# Altium schematic sheet Inertial_systems.SchDoc
size A4; SheetNumber: 9; SheetTotal: 11
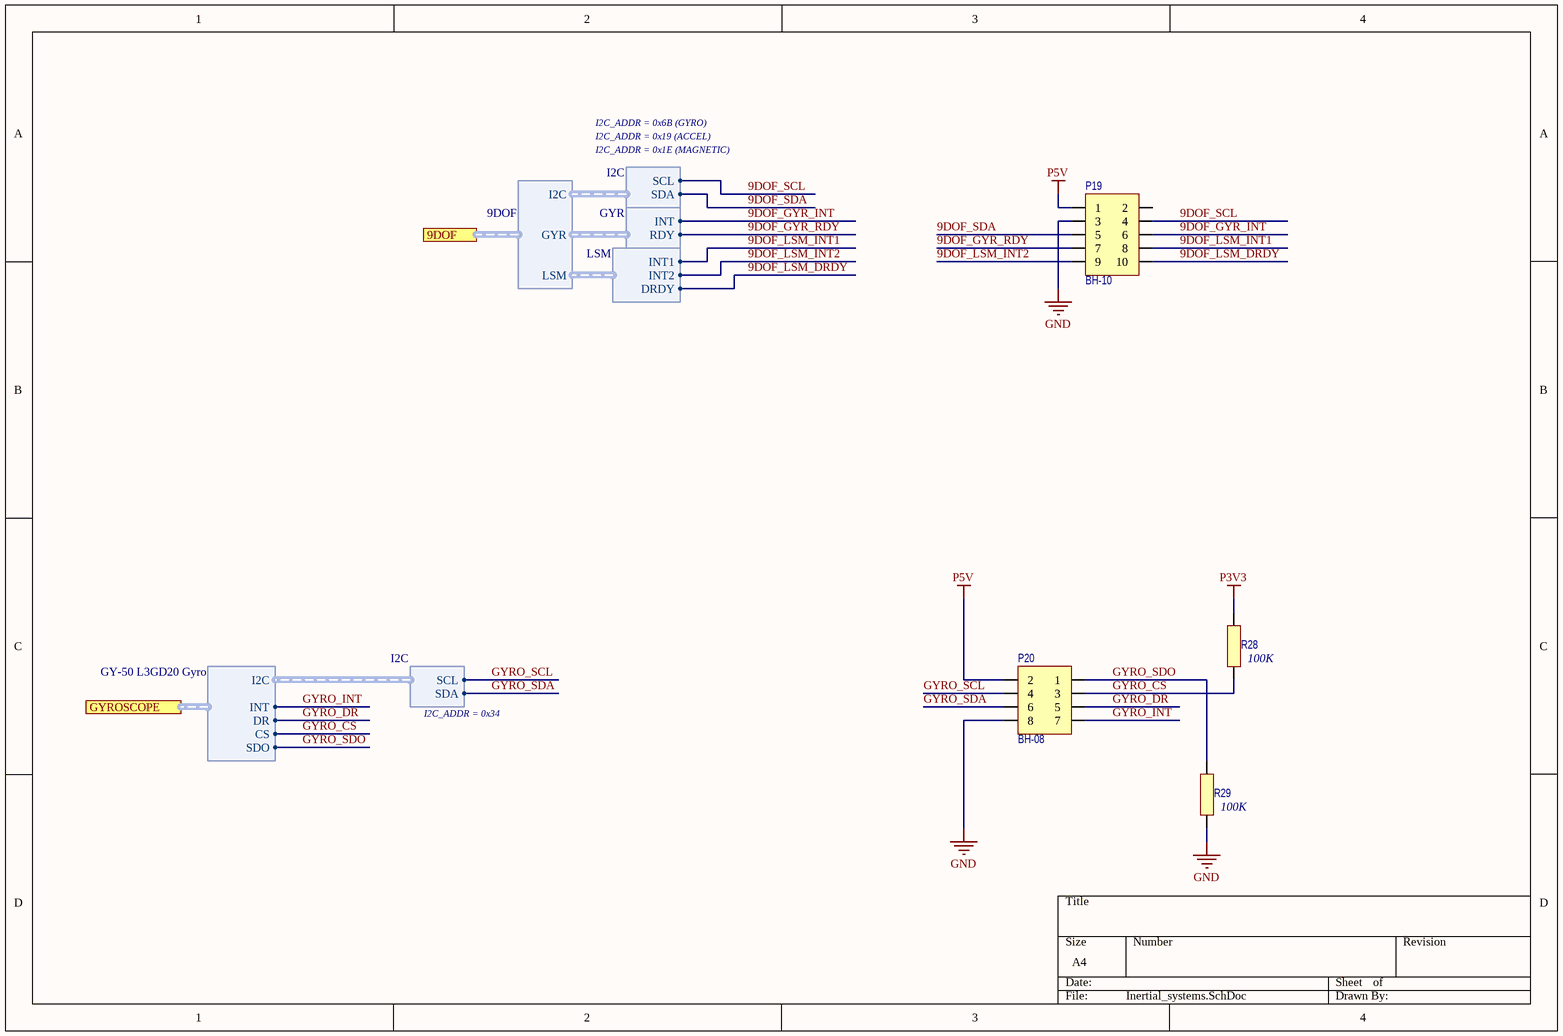
[diagram p0: Inertial_systems.SchDoc]

## Parts
P19  BH-10  [BH-10]
P20  BH-08  [BH-08]
R28  value 100K  [R0805]  (hidden comment: R0805)
R29  value 100K  [R0805]  (hidden comment: R0805)

## Ports
9DOF (harness 9DOF), GYROSCOPE (harness GY-50 L3GD20 Gyro)

## Harnesses
GY-50 L3GD20 Gyro: SDO, CS, I2C, DR, INT
I2C: SCL, SDA
9DOF: I2C, GYR, LSM
GYR: INT, RDY
LSM: INT1, DRDY, INT2

## Nets
GND: P19.3 P20.8 R29.1
P3V3: R28.2
P5V: P19.1 P20.2
9DOF_GYR_INT: P19.6 ; harness GYR.INT
9DOF_GYR_RDY: P19.7 ; harness GYR.RDY
9DOF_LSM_DRDY: P19.10 ; harness LSM.DRDY
9DOF_LSM_INT1: P19.8 ; harness LSM.INT1
9DOF_LSM_INT2: P19.9 ; harness LSM.INT2
9DOF_SCL: P19.4 ; harness I2C.SCL
9DOF_SDA: P19.5 ; harness I2C.SDA
GYRO_CS: P20.3 R28.1 ; port GYROSCOPE.CS
GYRO_DR: P20.5 ; port GYROSCOPE.DR
GYRO_INT: P20.7 ; port GYROSCOPE.INT
GYRO_SCL: P20.4 ; harness I2C.SCL
GYRO_SDA: P20.6 ; harness I2C.SDA
GYRO_SDO: P20.1 R29.2 ; port GYROSCOPE.SDO

Not connected (* = marked no-connect by the designer): P19 2

## Notes on the sheet
- I2C_ADDR = 0x6B (GYRO)
- I2C_ADDR = 0x19 (ACCEL)
- I2C_ADDR = 0x1E (MAGNETIC)
- I2C_ADDR = 0x34

## Library data of the parts
R28 R29 = R0805: Case: *; Mount: *; PartNumber: *; Power: *; Tolerance: *